# Altium schematic sheet hall_sensor.SchDoc
size A4
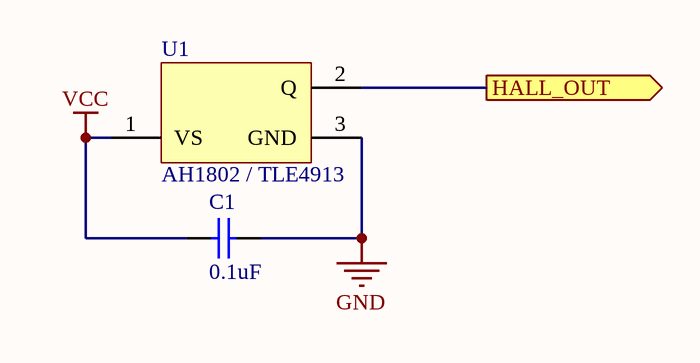
[diagram p0: hall_sensor.SchDoc]

## Parts
C1  0.1uF  [CAPC1608X87X35NL15T15]
U1  AH1802 / TLE4913  [INF-PG-SC59_M]

## Ports
HALL_OUT (out)

## Nets
GND: C1.2 U1.3(GND)
VCC: C1.1 U1.1(VS)
HALL_OUT: U1.2(Q) ; port HALL_OUT

## Library data of the parts
C1 = CMP-2006-03300-1: Part Number: C0603X104K5RACTU; Manufacturer: Kemet
U1 = CMP-1148-00005-1: Low Power Hall Switch, PG-SC59, Reel, Green; Manufacturer: Infineon; Direction Detection: FALSE; Green: TRUE; Interface: open collector; Bhyst (25degreesC) max: 0.8Â mT; Target Application: Consumer, Mobile (Low power); Bop (25degreesC) min: 3.5Â mT; Brp (25degreesC) typ: 2.7Â mT; ComponentLink3Description: Package Specification; DatasheetVersion: Rev. 2.2; ComponentLink1Description: Manufacturer URL; PackageVersion: Mar-08; PackageReference: PG-SC59; PartNumber: AH1802; Type: Omnipolar Switch; ComponentLink2Description: Datasheet; Packing: Reel; Mounting Technology: Surface Mount; PackageDescription: 3-Pin Semiconductor Package, 3 x 1.53 mm Body, 0.95 mm Pitch; ComponentLink2URL: http://www.infineon.com/dgdl/TLE4913_Data_Sheet_2006_03_16.pdf?folderId=db3a30431689f4420116a096e1db033e&fileId=db3a304316f66ee80117544449e10647; Chopped Hall Technology: TRUE; ComponentLink1URL: http://www.infineon.com/; ComponentLink3URL: http://www.infineon.com/dgdl/SC59-Package_Overview.pdf?folderId=db3a30431936bc4b01194dc0d34440b0&fileId=db3a30431936bc4b01194dd1aa1d40cf